# EAGLE design battery holder (EAGLE 6.3)
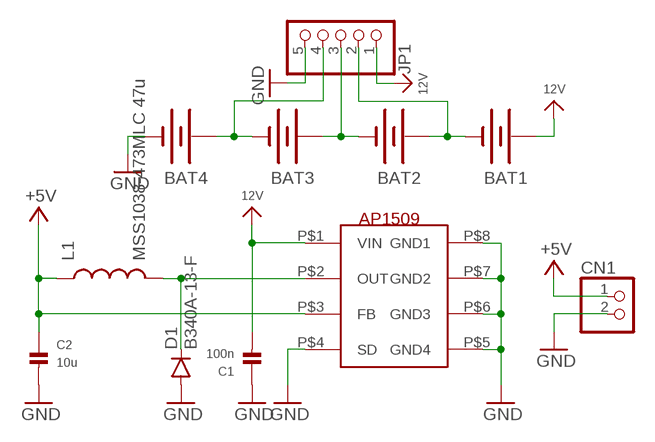
[diagram p0: schematic, sheet 1]

## Parts
BAT1  BATTERY18650  [BATTERY_18650-HOLDER]
BAT2  BATTERY18650  [BATTERY_18650-HOLDER]
BAT3  BATTERY18650  [BATTERY_18650-HOLDER]
BAT4  BATTERY18650  [BATTERY_18650-HOLDER]
C1  100n  CAP_CERAMIC_0603MP  [_0603MP]
C2  10u  CAP_CERAMIC_0805MP  [_0805MP]
CN1  JST_2PIN  [JSTPH2]
D1  B340A-13-F  DIODESMA  [SMA-DIODE]
JP1  PINHD-1X5/90  [1X05/90]
L1  MSS1038-473MLC 47u  INDUCTORPWR  [CDRH125]
U$3  AP1509  [SOP-8L]

## Nets
12V: BAT1.PWR@1(+) C1.2 JP1.1 U$3.P$1(VIN)
+5V: C2.1 CN1.1 L1.1 U$3.P$3(FB)
GND: BAT4.GND@1(-) C1.1 C2.2 CN1.2 D1.A JP1.5 U$3.P$4(SD) U$3.P$5(GND4) U$3.P$6(GND3) U$3.P$7(GND2) U$3.P$8(GND1)
N$1: BAT1.GND@1(-) BAT2.PWR@1(+) JP1.2
N$2: BAT2.GND@1(-) BAT3.PWR@1(+) JP1.3
N$3: BAT3.GND@1(-) BAT4.PWR@1(+) JP1.4
N$6: D1.C L1.2 U$3.P$2(OUT)

## Library data of the parts
BAT1-BAT4 = SparkFun-Electromechanical:BATTERY: Battery Holders Various common sizes : AA, AAA, 18650 (PRT-12895), 20mm coin cell and 12mm coin cell. 20MM_4LEGS, BATT-10373
C1 C2 = microbuilder:CAP_CERAMIC: Ceramic Capacitors 0402 - 0402 Surface Mount Capacitors 16pF 50V 5% [Digikey: 445-4899-2-ND] 18pF 50V 5% [Digikey: 490-1281-2-ND] 22pF 50V 5% [Digikey: 490-1283-2-ND] 68pF 50V 5% [Digikey: 490-1289-2-ND] 0.1uF 10V 10% [Digikey: 490-1318-2-ND] 1.0uF 6.3V 10% [Digikey: 490-1320-2-ND] 0603 - 0603 Surface Mount Capacitors 16 pF 50V 5% [Digikey: 445-5051-2-ND] 22 pF 50V [Digikey: PCC220ACVTR-ND] 33 pF 50V 5% [Digikey: 490-1415-1-ND] 56pF 50V 5% [Digikey: 490-1421-1-ND] 220pF 50V 5% [Digikey: 445-1285-1-ND] 680 pF 50V 2200 pF 50V 5% C0G [Digikey: 445-1297-1-ND] 5600 pF 100V 5% X7R [Digikey: 478-3711-1-ND] 0.1 µF 25V 10% [Digikey: PCC2277TR-ND] 0.22 µF 16V 10% X7R [Digikey: 445-1318-1-ND] 1.0 µF 25V 10% [Digikey: 445-5146-2-ND] 0603 - RF Specific 3pF 250V +/-0.1pF RF [Digikey: 712-1347-1-ND] 18 pF 250V 5% [Digikey: 478-3505-1-ND or 712-1322-1-ND] 56 pF 250V 5% C0G RF [Digikey: 490-4867-1-ND] 68 pF 250V RF [Digikey: 490-4868-1-ND] 0805 - 0805 Surface Mount Capacitors 220 pF 250V 2% RF Ceramic Capacitor [Digikey: 712-1398-1-ND] 1000 pF 50V 2% NP0 Ceramic Capacitor [Digikey: 478-3760-1-ND] 0.1 µF 25V 10% Ceramic Capacitor [Digikey: PCC1828TR-ND] 1.0 µF 16V 10% Ceramic Capacitor[Digikey: 490-1691-2-ND] 10.0 µF 10V 10% Ceramic Capacitor[Digikey: 709-1228-1-ND] 10.0 uF 16V 10% Ceramic Capacitor [Digikey: 478-5165-2-ND] 47 uF 6.3V 20% Ceramic Capacitor [Digikey: 587-1779-1-ND or 399-5506-1-ND] 1206 - 1206 Surface Mount Capacitors 47uF 10V 20% Ceramic Capacitor [Digikey: 490-5528-1-ND or 399-5508-1-ND or 445-6010-1-ND] 100uF 6.3V -20%, +80% Y5V Ceramic Capacitor (Digikey: 490-4512-1-ND, Mouser: 81-GRM31CF50J107ZE1L)
CN1 = microbuilder:JST_2PIN: JST 2-Pin Right-Angle Connector PH-Series - 4UConnector: 17311 SH-Series - 4UConnector: 07278
D1 = SparkFun-DiscreteSemi:DIODE: Diode These are standard reverse protection diodes and small signal diodes. SMA package can handle up to about 1A. SOD-323 can handle about 200mA. What the SOD-323 package when ordering, there are some mfgs out there that are 5-pin packages.
JP1 = pinhead:PINHD-1X5: PIN HEADER
L1 = SparkFun-Passives:INDUCTOR: Inductors Basic Inductor/Choke - 0603 and 1206. Footprints are not proven and vary greatly between part numbers. SRN6045- 33uH, 20% 1.4A SDR0403-560KL - 56uH, 10%, 500mA RMS/740mA peak
U$3 = unicorn_v2:AP1509

## Board
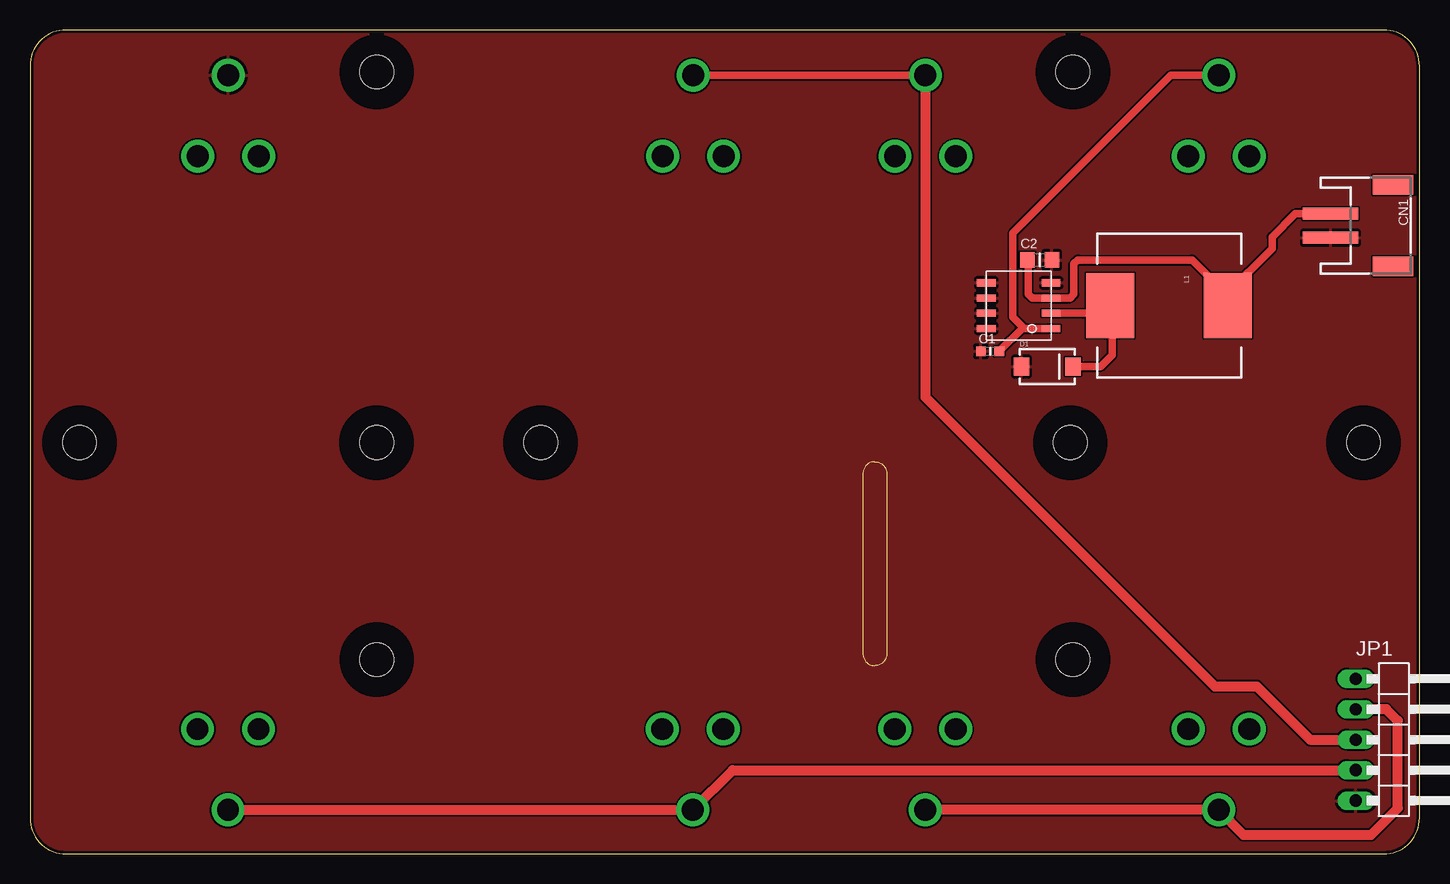
[diagram p1: board, top side]
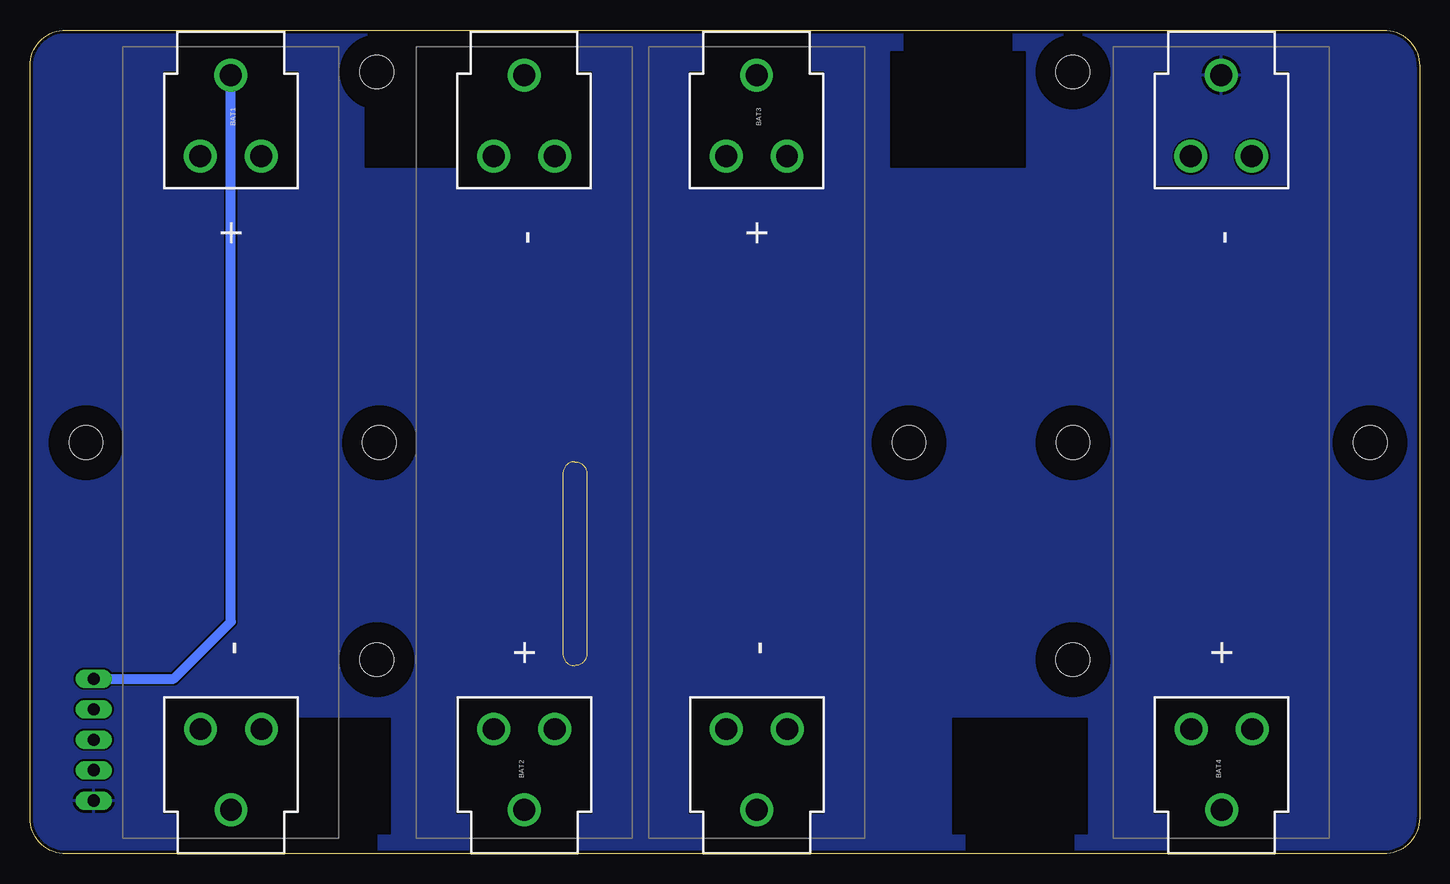
[diagram p2: board, bottom side, seen from below]

Size 115.8 x 68.7 mm. Coordinates in mm from the lower left corner, seen from the top.
Outline: 0,3 arc90 3,0 112.8,0 arc90 115.8,3 115.8,65.7 arc90 112.8,68.7 3,68.7 arc90 0,65.7 0,3
Copper layers (1*16): Top 0.035mm / dielectric 1.5mm / Bottom 0.035mm
Design rules "ITEADstudio_DRC": minimum track width 6mil, minimum drill 12mil, track to track 6mil, track to pad 6mil, pad to pad 6mil, via to via 6mil, smd to smd 0mil, copper to edge 10mil, drill to drill 10mil, minimum pad ring 10mil, minimum via ring 6mil, stop-mask expansion 2mil, vias tented up to drill 100mil, thermal gap 10mil
Holes 2.8 mm at 28.9,16.2 28.9,65.2 86.9,65.2 86.9,16.2 42.55,34.3 86.69,34.3 111.13,34.3 28.88,34.3 4.12,34.3
tRestrict: area 27.3,63.7 to 30.4,66.8; area 85.3,63.7 to 88.4,66.8; area 85.3,14.6 to 88.4,17.8; area 27.3,14.6 to 30.4,17.8; area 27.3,14.6 to 30.4,17.8; area 41,32.7 to 44.1,35.8; area 41,32.7 to 44.1,35.8; area 85.1,32.7 to 88.2,35.8; area 85.1,32.7 to 88.2,35.8; area 109.6,32.7 to 112.7,35.8; area 109.6,32.7 to 112.7,35.8; area 27.3,32.7 to 30.4,35.8; 3 more areas
bRestrict: area 27.3,14.6 to 30.4,17.8; area 27.3,63.7 to 30.4,66.8; area 85.3,14.6 to 88.4,17.8; area 85.3,63.7 to 88.4,66.8; area 41,32.7 to 44.1,35.8; area 85.1,32.7 to 88.2,35.8; area 109.6,32.7 to 112.7,35.8; area 27.3,32.7 to 30.4,35.8; area 2.6,32.7 to 5.7,35.8
Milling: 6 lines

### Footprints (pad centres in the part's own frame; a part is rotated, then mirrored left to right if it is on the bottom)
BATTERY_18650-HOLDER = drill 1.829: GND@1 30.628,0.01; GND@2 23.88,2.55; GND@3 23.88,-2.53; PWR@1 -30.628,-0.01; PWR@2 -23.88,2.53; PWR@3 -23.88,-2.55
_0603MP = smd 0.8 x 0.8: 1 -0.762,0; 2 0.762,0
_0805MP = smd 1.2 x 1.3: 1 -1.016,0; 2 1.016,0
JSTPH2 = smd 1 x 4.6: 1 -1,-3.7; 2 1,-3.7 | smd 1.6 x 3.4: NC1 -3.4,1.5; NC2 3.4,1.5
SMA-DIODE = smd 1.27 x 1.47: A -2.15,0; C 2.15,0
1X05/90 = drill 1.016 long: 1 -5.08,-3.81; 2 -2.54,-3.81; 3 0,-3.81; 4 2.54,-3.81; 5 5.08,-3.81
CDRH125 = smd 5.4 x 4: 1 0,4.9; 2 0,-4.9
SOP-8L = smd 0.6 x 1.55: P$1 -1.905,-2.54; P$2 -0.635,-2.54; P$3 0.635,-2.54; P$4 1.905,-2.54; P$5 1.905,2.86; P$6 0.635,2.86; P$7 -0.635,2.86; P$8 -1.905,2.86

### Placement (x,y rotation side)
BAT1  99.06,34.29 270 bottom
BAT2  74.61,34.29 90 bottom
BAT3  55.24,34.29 270 bottom
BAT4  16.51,34.29 90 bottom
C1  80.01,41.91 0 top
C2  84.14,49.53 0 top
CN1  112.08,52.39 270 top
D1  84.77,40.64 0 top
JP1  114.3,9.52 270 top
L1  94.93,45.72 270 top
U$3  82.55,45.72 90 top

### Tracks (layer width: path | path; a pad name or v marks a point on that pad's centre or on a via)
12V
  Top 0.61: C1.2 82.68,43.81 82.87,43.81 | 82.87,43.81 U$3.P$1 | BAT1.PWR@1 95.08,64.92 81.91,51.75 81.91,44.77 82.87,43.81
  Bottom 0.813: JP1.1 103.82,14.6 99.07,19.36 BAT1.PWR@1
+5V
  Top 0.61: 109.22,53.34 108.43,53.34 CN1.1 105.46,53.39 103.5,51.44 103.5,50.48 99.69,46.67 | C2.1 83.19,49.47 83.19,46.67 83.5,46.36 U$3.P$3 86.68,46.36 87,46.67 87,49.21 87.31,49.53 96.84,49.53 99.69,46.67 | 99.69,46.67 99.69,45.86 L1.1
GND
  pour Bottom: 0,3 arc90 3,0 112.8,0 arc90 115.8,3 115.8,65.7 arc90 112.8,68.7 3,68.7 arc90 0,65.7
  pour Top: 0,3 arc90 3,0 112.8,0 arc90 115.8,3 115.8,65.7 arc90 112.8,68.7 3,68.7 arc90 0,65.7
N$1
  Top 0.813: BAT2.PWR@1 BAT1.GND@1 101.12,1.59 111.76,1.59 113.98,3.81 113.98,11.11 113.03,12.06 JP1.2
N$2
  Top 0.61: BAT3.PWR@1 BAT2.GND@1
  Top 0.813: BAT2.GND@1 74.62,38.09 98.74,13.97 102.23,13.97 106.68,9.52 JP1.3
N$3
  Top 0.813: BAT4.PWR@1 BAT3.GND@1 58.56,6.98 JP1.4
N$6
  Top 0.61: U$3.P$2 89.4,45.08 | 89.4,45.08 L1.2 | D1.C 89.22,40.64 90.17,41.59 90.17,45.08 89.4,45.08